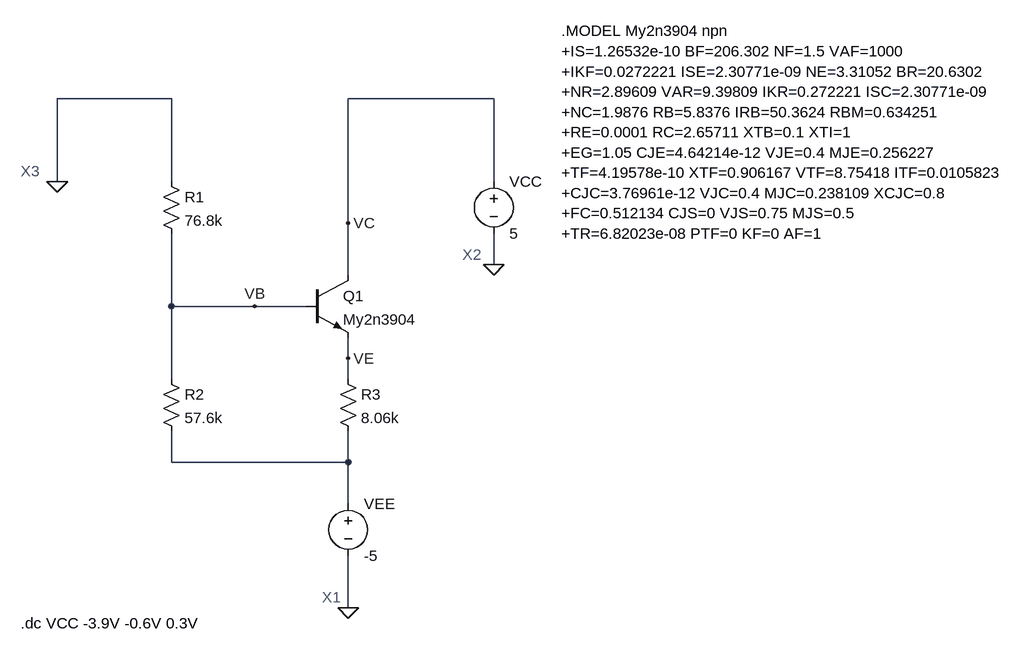
[diagram p0: schematic Part1A.asc]
Part1A.asc, the LTspice schematic file:
Version 4
SHEET 1 1520 680
WIRE 176 -160 0 -160
WIRE 672 -160 448 -160
WIRE 0 -32 0 -160
WIRE 176 -32 176 -160
WIRE 672 -32 672 -160
WIRE 448 32 448 -160
WIRE 672 96 672 48
WIRE 448 112 448 32
WIRE 176 160 176 48
WIRE 304 160 176 160
WIRE 384 160 304 160
WIRE 448 240 448 208
WIRE 176 272 176 160
WIRE 448 272 448 240
WIRE 176 400 176 352
WIRE 448 400 448 352
WIRE 448 400 176 400
WIRE 448 464 448 400
WIRE 448 624 448 544
FLAG 0 -32 0
FLAG 448 624 0
FLAG 672 96 0
FLAG 304 160 VB
FLAG 448 32 VC
FLAG 448 240 VE
SYMBOL res 160 -48 R0
SYMATTR InstName R1
SYMATTR Value 76.8k
SYMBOL res 160 256 R0
SYMATTR InstName R2
SYMATTR Value 57.6k
SYMBOL res 432 256 R0
SYMATTR InstName R3
SYMATTR Value 8.06k
SYMBOL voltage 448 448 R0
WINDOW 123 0 0 Left 0
WINDOW 39 0 0 Left 0
SYMATTR InstName VEE
SYMATTR Value -5
SYMBOL voltage 672 -48 R0
WINDOW 123 0 0 Left 0
WINDOW 39 0 0 Left 0
SYMATTR InstName VCC
SYMATTR Value 5
SYMBOL npn 384 112 R0
SYMATTR InstName Q1
SYMATTR Value My2n3904
TEXT -56 -48 Left 2 ;X3
TEXT 408 608 Left 2 ;X1
TEXT 624 80 Left 2 ;X2
TEXT 776 -264 Left 2 !.MODEL My2n3904 npn\n+IS=1.26532e-10 BF=206.302 NF=1.5 VAF=1000\n+IKF=0.0272221 ISE=2.30771e-09 NE=3.31052 BR=20.6302\n+NR=2.89609 VAR=9.39809 IKR=0.272221 ISC=2.30771e-09\n+NC=1.9876 RB=5.8376 IRB=50.3624 RBM=0.634251\n+RE=0.0001 RC=2.65711 XTB=0.1 XTI=1\n+EG=1.05 CJE=4.64214e-12 VJE=0.4 MJE=0.256227\n+TF=4.19578e-10 XTF=0.906167 VTF=8.75418 ITF=0.0105823\n+CJC=3.76961e-12 VJC=0.4 MJC=0.238109 XCJC=0.8\n+FC=0.512134 CJS=0 VJS=0.75 MJS=0.5\n+TR=6.82023e-08 PTF=0 KF=0 AF=1
TEXT -56 648 Left 2 !.dc VCC -3.9V -0.6V 0.3V

The netlist it stands for:
* Part1A.asc
R1 0 VB 76.8k
R2 VB N001 57.6k
R3 VE N001 8.06k
VEE N001 0 -5
VCC VC 0 5
Q1 VC VB VE 0 My2n3904
.model NPN NPN
.model PNP PNP
.lib standard.bjt
* X3
* X1
* X2
.MODEL My2n3904 npn
+IS=1.26532e-10 BF=206.302 NF=1.5 VAF=1000
+IKF=0.0272221 ISE=2.30771e-09 NE=3.31052 BR=20.6302
+NR=2.89609 VAR=9.39809 IKR=0.272221 ISC=2.30771e-09
+NC=1.9876 RB=5.8376 IRB=50.3624 RBM=0.634251
+RE=0.0001 RC=2.65711 XTB=0.1 XTI=1
+EG=1.05 CJE=4.64214e-12 VJE=0.4 MJE=0.256227
+TF=4.19578e-10 XTF=0.906167 VTF=8.75418 ITF=0.0105823
+CJC=3.76961e-12 VJC=0.4 MJC=0.238109 XCJC=0.8
+FC=0.512134 CJS=0 VJS=0.75 MJS=0.5
+TR=6.82023e-08 PTF=0 KF=0 AF=1
.dc VCC -3.9V -0.6V 0.3V
.backanno
.end

* Results of the author's LTspice run, read from the files saved beside the schematic
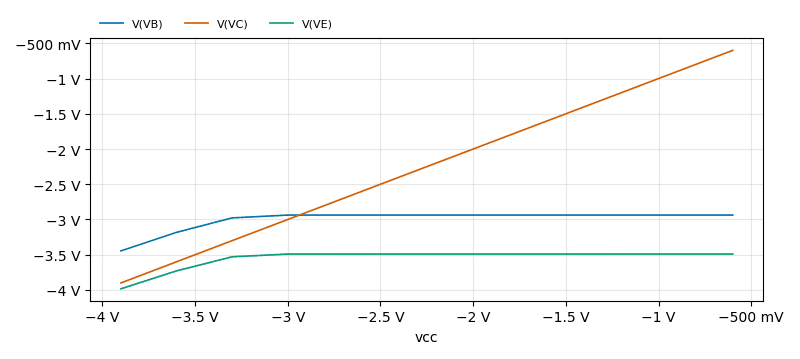
[diagram p1: DC transfer characteristic of Part1A.asc, plotted from the saved traces]
* DC transfer characteristic, 1 run:
*   V(VB): -3.446 V at vcc=-3.9 V, -2.937 V at vcc=-600 mV, min -3.446 V, max -2.937 V
*   V(VC): -3.9 V at vcc=-3.9 V, -600 mV at vcc=-600 mV, min -3.9 V, max -600 mV
*   V(VE): -3.983 V at vcc=-3.9 V, -3.49 V at vcc=-600 mV, min -3.983 V, max -3.49 V